# Altium schematic sheet Test_Points.SchDoc: Test Points
size A4; DocumentNumber: 7; SheetNumber: 7; SheetTotal: 8
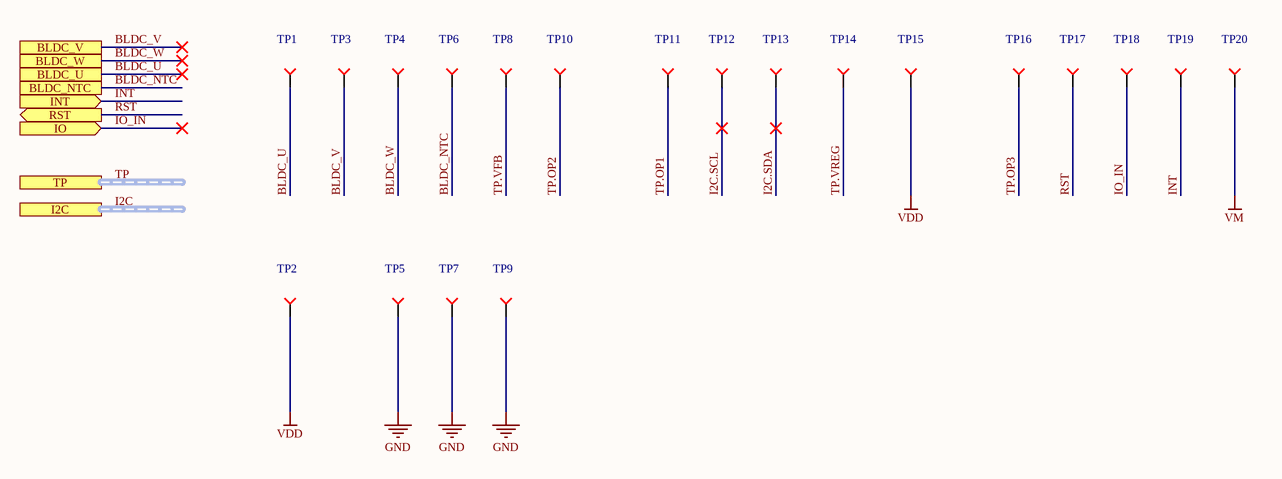
[diagram p0: Test_Points.SchDoc]

## Parts
TP1  Test Point Pad  [Testpoint]  (value not drawn)  (no BOM)
TP2  Test Point Pad  [Testpoint]  (value not drawn)  (no BOM)
TP3  Test Point Pad  [Testpoint]  (value not drawn)  (no BOM)
TP4  Test Point Pad  [Testpoint]  (value not drawn)  (no BOM)
TP5  Test Point Pad  [Testpoint]  (value not drawn)  (no BOM)
TP6  Test Point Pad  [Testpoint]  (value not drawn)  (no BOM)
TP7  Test Point Pad  [Testpoint]  (value not drawn)  (no BOM)
TP8  Test Point Pad  [Testpoint]  (value not drawn)  (no BOM)
TP9  Test Point Pad  [Testpoint]  (value not drawn)  (no BOM)
TP10  Test Point Pad  [Testpoint]  (value not drawn)  (no BOM)
TP11  Test Point Pad  [Testpoint]  (value not drawn)  (no BOM)
TP12  Test Point Pad  [Testpoint]  (value not drawn)  (no BOM)
TP13  Test Point Pad  [Testpoint]  (value not drawn)  (no BOM)
TP14  Test Point Pad  [Testpoint]  (value not drawn)  (no BOM)
TP15  Test Point Pad  [Testpoint]  (value not drawn)  (no BOM)
TP16  Test Point Pad  [Testpoint]  (value not drawn)  (no BOM)
TP17  Test Point Pad  [Testpoint]  (value not drawn)  (no BOM)
TP18  Test Point Pad  [Testpoint]  (value not drawn)  (no BOM)
TP19  Test Point Pad  [Testpoint]  (value not drawn)  (no BOM)
TP20  Test Point Pad  [Testpoint]  (value not drawn)  (no BOM)

## Ports
BLDC_NTC, BLDC_U, BLDC_V, BLDC_W, I2C (harness I2C), INT (in), IO (in), RST (out), TP (harness TP)

## Nets
GND: TP5.1 TP7.1 TP9.1
VDD: TP2.1 TP15.1
VM: TP20.1
BLDC_NTC: TP6.1 ; port BLDC_NTC
BLDC_U: TP1.1 ; port BLDC_U
BLDC_V: TP3.1 ; port BLDC_V
BLDC_W: TP4.1 ; port BLDC_W
I2C.SCL: TP12.1
I2C.SDA: TP13.1
INT: TP19.1 ; port INT
IO_IN: TP18.1 ; port IO
RST: TP17.1 ; port RST
TP.OP1: TP11.1
TP.OP2: TP10.1
TP.OP3: TP16.1
TP.VFB: TP8.1
TP.VREG: TP14.1

## Buses and harness runs
harness I2C = port I2C
harness TP = port TP

## Notes on the sheet
- Title:
- Number:
- Size:
- Date:
- A4
- Time:
- Revision:
- Sheet
- File:
- of

## Library data of the parts
TP1-TP20 = Test Point Pad: Test Point. There is nothing to buy or mount.; ClassName: TestPoint; CompType: TestPoint; Manufacturer: N/A; MountType: N/A; PackageReference: TetsPoint; PartNumber: N/A